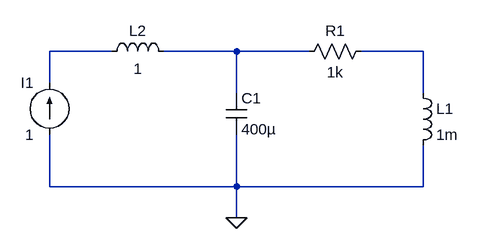
[diagram p0: schematic ssm.asc]
ssm.asc, the LTspice schematic file:
Version 4
SHEET 1 880 680
WIRE 16 224 -80 224
WIRE 208 224 96 224
WIRE 320 224 208 224
WIRE 496 224 400 224
WIRE -80 272 -80 224
WIRE 208 288 208 224
WIRE 496 288 496 224
WIRE -80 432 -80 352
WIRE 208 432 208 352
WIRE 208 432 -80 432
WIRE 496 432 496 368
WIRE 496 432 208 432
WIRE 208 480 208 432
FLAG 208 480 0
SYMBOL Res 416 208 R90
WINDOW 0 0 56 VBottom 2
WINDOW 3 32 56 VTop 2
SYMATTR InstName R1
SYMATTR Value 1k
SYMBOL ind 480 272 R0
SYMATTR InstName L1
SYMATTR Value 1m
SYMBOL Cap 192 288 R0
SYMATTR InstName C1
SYMATTR Value 400µ
SYMBOL ind 0 240 R270
WINDOW 0 32 56 VTop 2
WINDOW 3 5 56 VBottom 2
SYMATTR InstName L2
SYMATTR Value 1
SYMBOL current -80 352 R180
WINDOW 0 24 80 Left 2
WINDOW 3 24 0 Left 2
SYMATTR InstName I1
SYMATTR Value 1

The netlist it stands for:
* ssm.asc
R1 N003 N002 1k
L1 N003 0 1m
C1 N002 0 400µ
L2 N001 N002 1
I1 0 N001 1
.backanno
.end